# EAGLE design Laser Breakout (EAGLE 6.5.0)
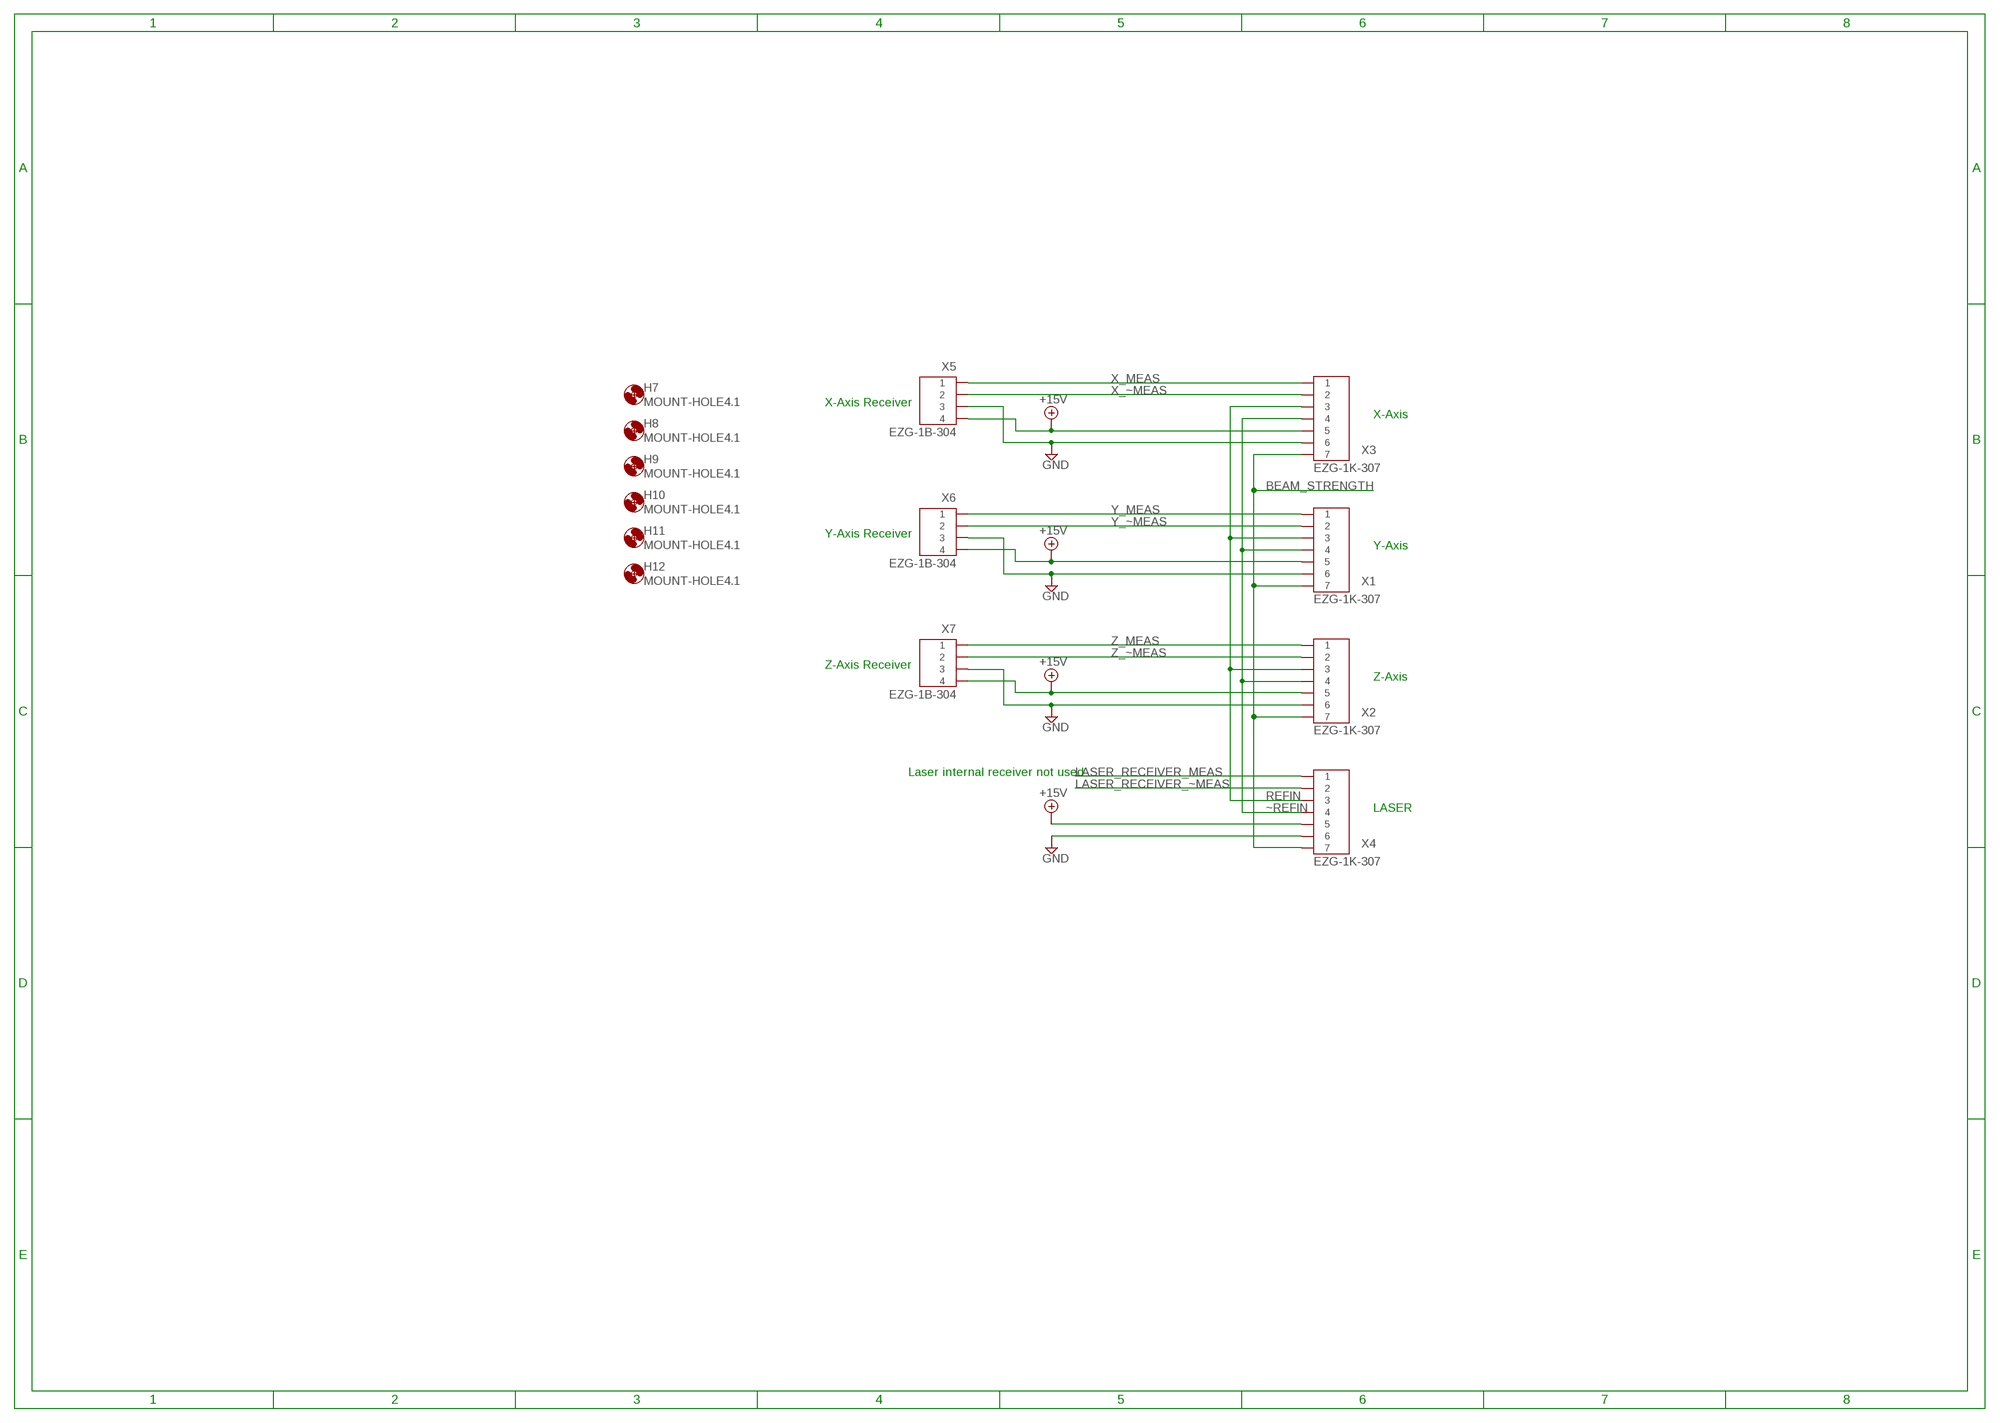
[diagram p0: schematic, sheet 1]

## Parts
H7  MOUNT-HOLE4.1  [4,1]
H8  MOUNT-HOLE4.1  [4,1]
H9  MOUNT-HOLE4.1  [4,1]
H10  MOUNT-HOLE4.1  [4,1]
H11  MOUNT-HOLE4.1  [4,1]
H12  MOUNT-HOLE4.1  [4,1]
X1  EZG-1K-307  [EZG-1B-1K-307]
X2  EZG-1K-307  [EZG-1B-1K-307]
X3  EZG-1K-307  [EZG-1B-1K-307]
X4  EZG-1K-307  [EZG-1B-1K-307]
X5  EZG-1B-304  [EZG-1B-1K-304]
X6  EZG-1B-304  [EZG-1B-1K-304]
X7  EZG-1B-304  [EZG-1B-1K-304]

## Nets
+15V: X1.5 X2.5 X3.5 X4.5 X5.4 X6.4 X7.4
BEAM_STRENGTH: X1.7 X2.7 X3.7 X4.7
GND: X1.6 X2.6 X3.6 X4.6 X5.3 X6.3 X7.3
LASER_RECEIVER_MEAS: X4.1
LASER_RECEIVER_~MEAS: X4.2
REFIN: X1.3 X2.3 X3.3 X4.3
X_MEAS: X3.1 X5.1
X_~MEAS: X3.2 X5.2
Y_MEAS: X1.1 X6.1
Y_~MEAS: X1.2 X6.2
Z_MEAS: X2.1 X7.1
Z_~MEAS: X2.2 X7.2
~REFIN: X1.4 X2.4 X3.4 X4.4

## Notes on the sheet
- X-Axis Receiver
- X-Axis
- Y-Axis Receiver
- Y-Axis
- Z-Axis Receiver
- Z-Axis
- Laser internal receiver not used
- LASER

## Library data of the parts
H7-H12 = holes:MOUNT-HOLE: MOUNTING HOLE with drill center marker
X1-X4 = con-lemo:EZG-?-307: LEMO Connector Source: http://www.lemo.com/pdfs/catalog/ROW/German/unipole_multipole.pdf; OC_FARNELL: unknown; OC_NEWARK: unknown
X5-X7 = con-lemo:EZG-?-304: LEMO Connector Source: http://www.lemo.com/pdfs/catalog/ROW/German/unipole_multipole.pdf; OC_FARNELL: unknown; OC_NEWARK: unknown

## Net classes
0 default: width 0.152 mm, drill 0.152 mm, clearance 0.152 mm

## Board
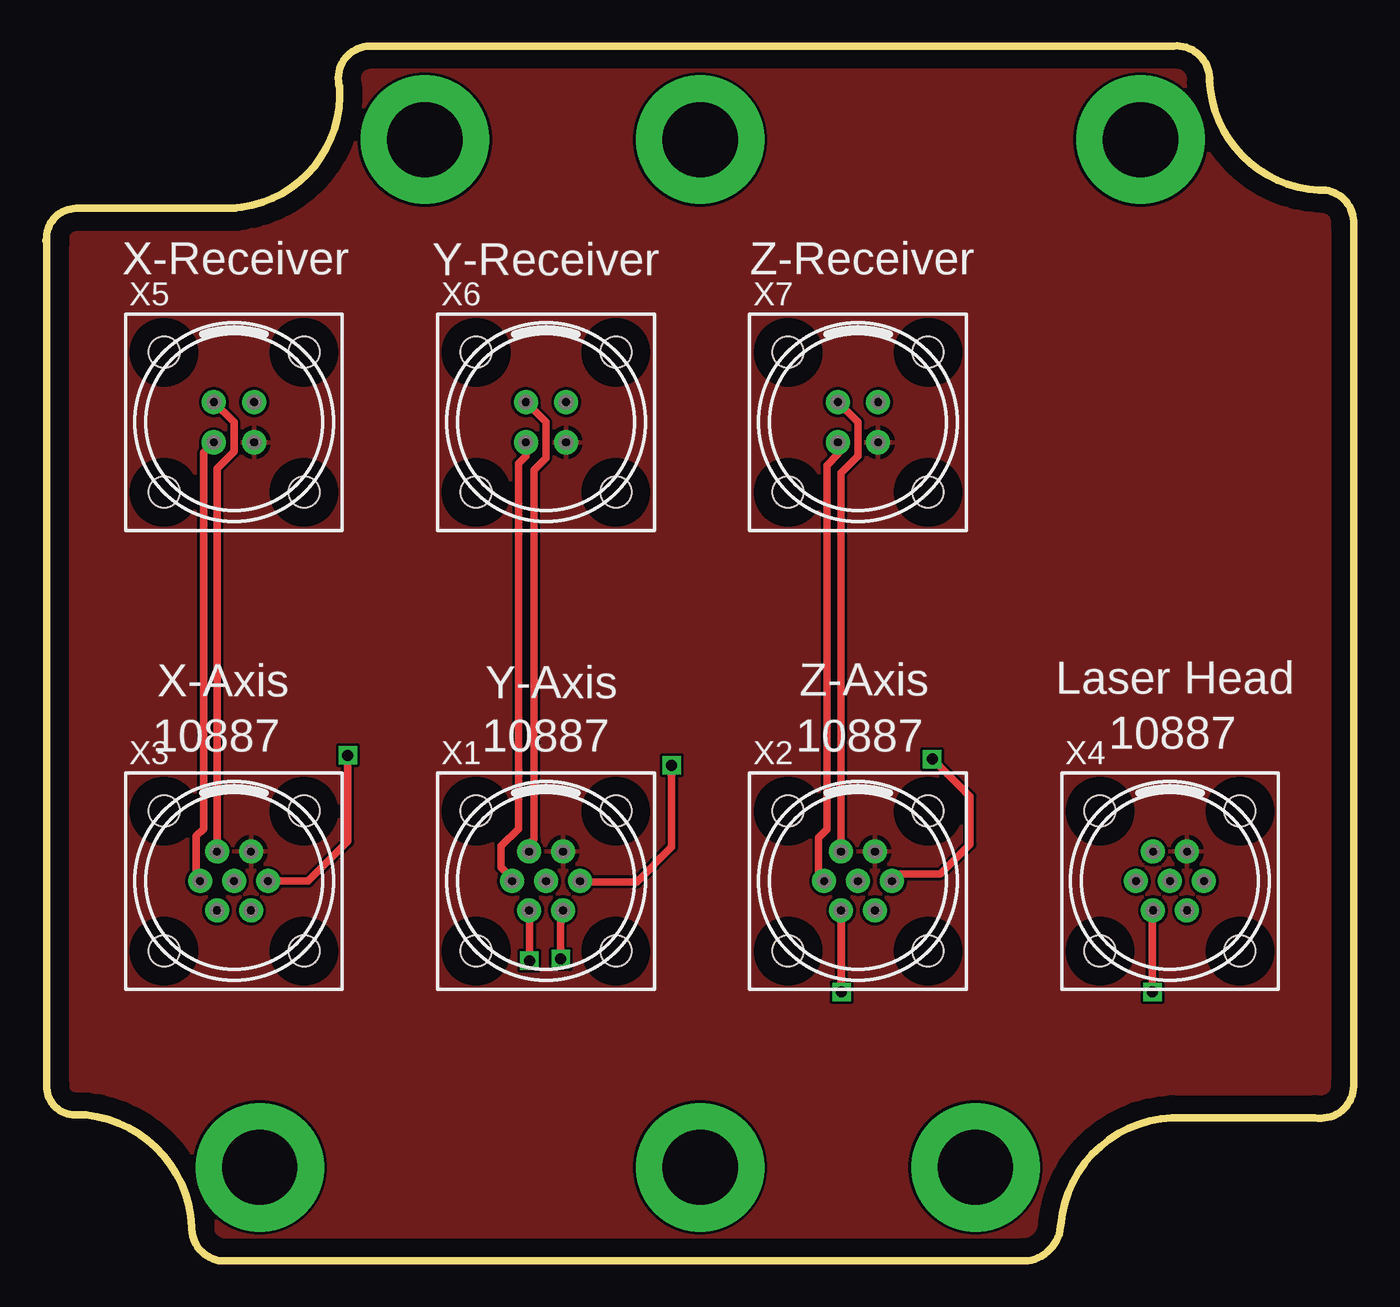
[diagram p1: board, top side]
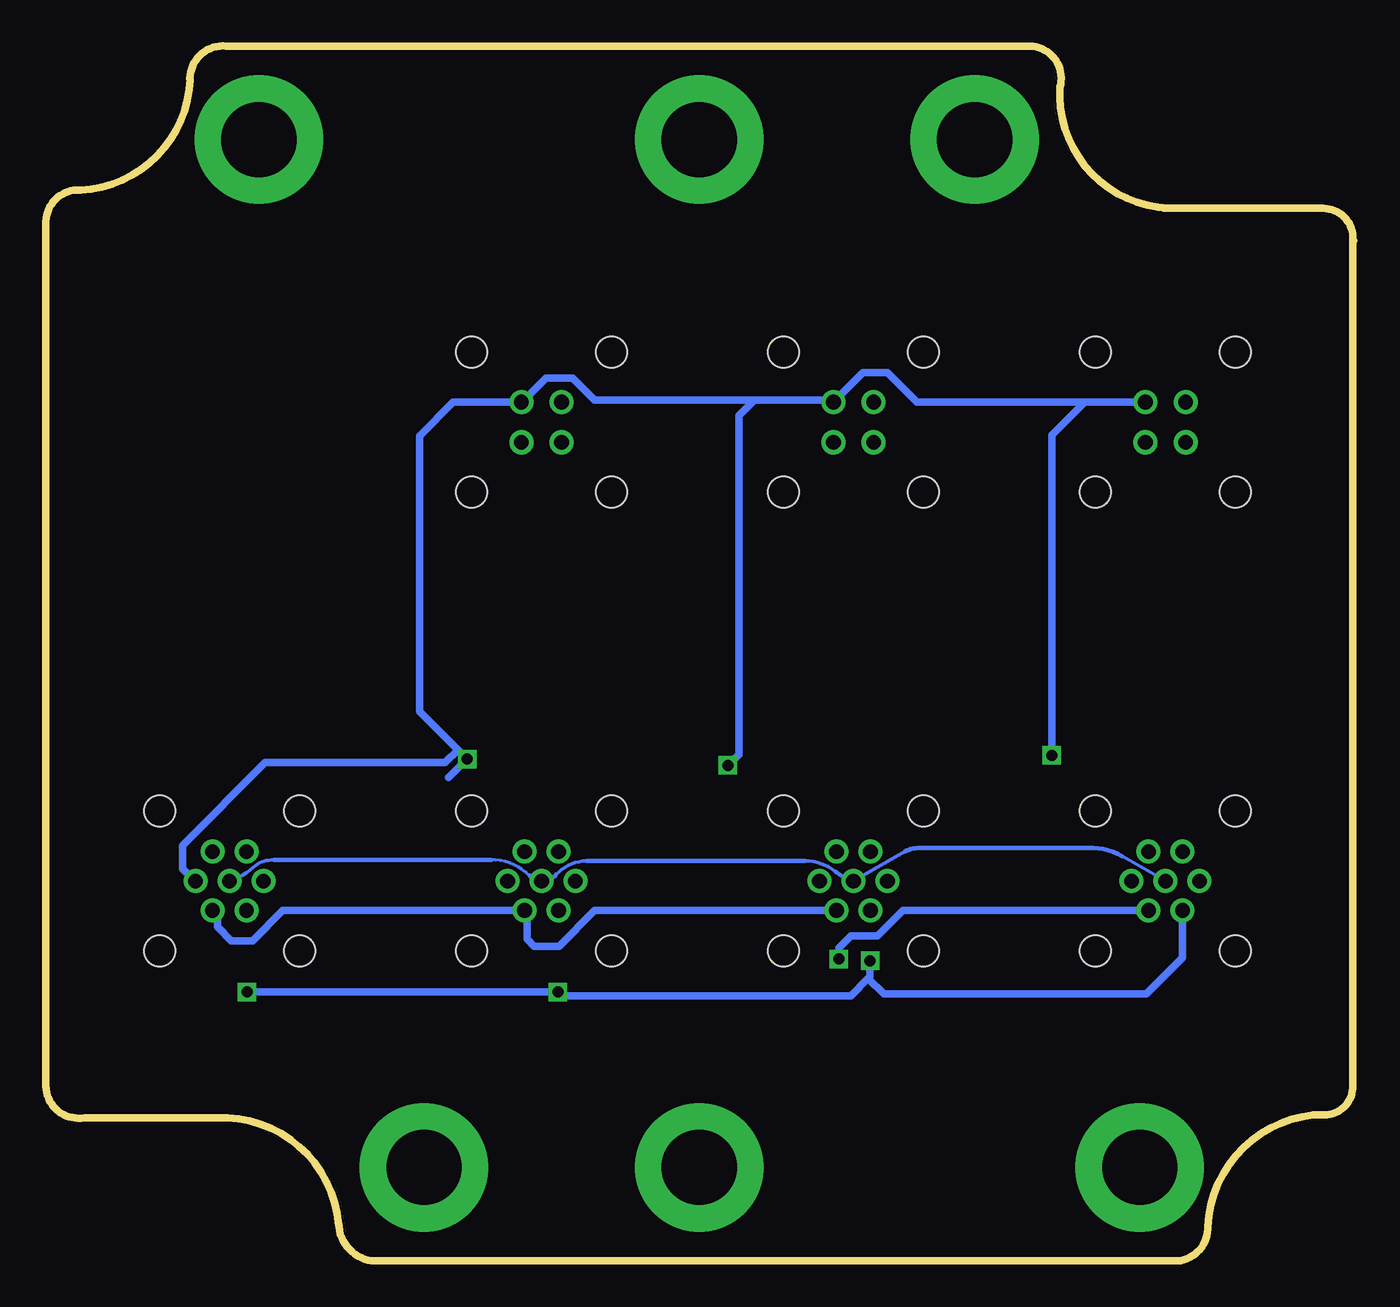
[diagram p2: board, bottom side, seen from below]

Size 71.25 x 66.21 mm. Coordinates in mm from the lower left corner, seen from the top.
Outline: 0.05,55.5 0.05,9.55 arc92 1.6,7.95 2.2,7.95 arc-81 7.95,1.85
Outline: 0.05,55.5 0.05,55.55 0,55.6
Outline: 9.6,0 arc-89 7.95,1.9
Outline: 9.65,0 53.1,0
Outline: 53.1,0 53.2,0
Outline: 55.3,1.95 arc-83 61.35,7.8 69.15,7.8 arc104 71.25,9.7 71.25,56.4
Outline: 55.3,2.05 arc-93 53.1,0
Outline: 17.55,66.2 61.45,66.2 arc-99 63.4,64.25
Outline: 69.35,58.35 arc-85 63.4,64.4
Outline: 69.4,58.35 arc-97 71.25,56.5
Outline: 0.05,55.5 arc-98 1.65,57.35 10.1,57.35
Outline: 10.1,57.35 10.35,57.35
Outline: 16,64 arc-91 10.1,57.35
Outline: 16,63.95 arc-105 17.65,66.2
Copper layers (1*16): Top 0.035mm / dielectric 1.5mm / Bottom 0.035mm
Design rules "default *": minimum track width 6mil, minimum drill 15mil, track to track 6mil, track to pad 6mil, pad to pad 6mil, via to via 6mil, smd to smd 6mil, copper to edge 40mil, drill to drill 8mil, minimum pad ring 10mil, minimum via ring 8mil, stop-mask expansion 4mil, vias tented up to drill 0mil, thermal gap 10mil

### Footprints (pad centres in the part's own frame; a part is rotated, then mirrored left to right if it is on the bottom)
4,1 = drill 4.1 pad 7: P$1 0,0
EZG-1B-1K-307 = drill 0.8 pad 1.3: 1 -0.925,1.602; 2 -1.85,0; 3 -0.925,-1.602; 4 0.925,-1.602; 5 1.85,0; 6 0.925,1.602; 7 0,0 | hole 1.7: -3.81,3.81; 3.81,3.81; 3.81,-3.81; -3.81,-3.81
EZG-1B-1K-304 = drill 0.8 pad 1.1: 1 -1.096,1.096; 2 -1.096,-1.096; 3 1.096,-1.096; 4 1.096,1.096 | hole 1.7: -3.81,3.81; 3.81,3.81; 3.81,-3.81; -3.81,-3.81

### Placement (x,y rotation side)
H7  11.65,5.1 0 top
H8  35.65,5.1 0 top
H9  50.65,5.1 0 top
H10  20.65,61.1 0 top
H11  35.65,61.1 0 top
H12  59.65,61.1 0 top
X1  27.25,20.7 0 top
X2  44.25,20.7 0 top
X3  10.25,20.7 0 top
X4  61.25,20.7 0 top
X5  10.25,45.7 0 top
X6  27.25,45.7 0 top
X7  44.25,45.7 0 top

### Tracks (layer width: path | path; a pad name or v marks a point on that pad's centre or on a via)
+15V  (via drill 0.6)
  Top 0.406: X2.5 46.15,20.7 46.55,21.1 48.75,21.1 50.35,22.7 50.35,25.3 v48.3,27.35 | X5.4 11.5,46.8 | v34.1,27 34.1,22.55 32.2,20.65 29.15,20.65 X1.5 | X3.5 14.3,20.7 16.45,22.85 v16.45,27.55
  Bottom 0.254: X6.4 | X7.4
  Bottom 0.406: X5.4 14.65,46.8 | 14.65,46.8 23.8,46.8 25.4,48.4 26.74,48.4 X6.4 28.45,46.9 32.65,46.9 | X4.5 63.15,20.7 63.8,21.35 63.8,22.65 59.3,27.15 49.5,27.15 48.8,27.85 | 49.3,26.35 v48.3,27.35 48.8,27.85 | 32.65,46.9 41.35,46.9 42.55,48.1 44,48.1 45.3,46.8 X7.4 49.05,46.8 50.9,44.95 50.9,29.95 48.8,27.85 | 32.65,46.9 33.5,46.05 33.5,27.6 v34.1,27 | v16.45,27.55 16.45,45 14.65,46.8
BEAM_STRENGTH
  Bottom 0.152: 44.9,21 arc-46 47,21.85 | X3.7 12.6,22.05
  Bottom 0.178: 60.8,20.9 arc-18 59.95,21.45 arc44 58.85,21.85 | 43.45,21.05 arc46 41.8,21.8 | 29.9,21.8 arc39 28.2,21.2 | X1.7 24.45,22.3
  Bottom 0.254: X4.7 60.8,20.9 | 58.85,21.85 47,21.85 | 44.9,21 44.6,20.7 X2.7 arc-47 43.45,21.05 | 41.8,21.8 29.9,21.8 | 12.6,22.05 arc-32 14.45,22.5 23.65,22.5 arc-31 24.45,22.3 | 28.2,21.2 arc-22 X1.7
GND
  Top 0.406: 45.17,44.44 X7.3
  pour Top: 2,7.95 1.1,7.95 0.1,8.95 0.1,56.25 1.2,57.35 10.25,57.35 arc104 15.95,64.6 arc-90 17.6,66.25 18.75,66.25 61.95,66.25 62,66.25 62.15,66.1 62.35,66.1 63.4,65.05 63.4,65 arc85 69.5,58.35 arc-77 71.3,56.65 71.25,56.6 71.25,9.4 71.25,9.2 71.25,9 70.05,7.8 69.35,7.8 61.25,7.8 arc90 55.3,1.9 arc-104 52.9,0.05 9.5,0.05 arc-98 7.9,1.9 arc51 6.9,5.1 arc15 4,7.5 arc39
REFIN  (via drill 0.6)
  Top 0.406: X1.3 26.35,19.08 v26.35,16.35 | v60.3,14.65 60.3,19.08 X4.3 | v43.35,14.65 43.35,19.08 X2.3 43.33,14.68 v43.35,14.65
  Bottom 0.406: v26.35,16.35 26.35,15.5 26.45,15.4 | 26.45,15.4 27.4,14.45 43.15,14.45 v43.35,14.65 v60.3,14.65 | X3.3 9.32,16.53 11.3,14.55 25.6,14.55 26.45,15.4
X_MEAS
  Top 0.406: X3.1 9.32,43.18 10.25,44.1 10.25,45.7 X5.1
X_~MEAS
  Top 0.406: 8.9,44.61 X5.2 8.6,44.05 8.6,23.55 8.2,23.15 8.2,20.9 X3.2
Y_MEAS
  Top 0.406: X1.1 26.32,22.73 26.6,23 26.6,43.1 27.25,43.75 27.25,45.7 X6.1
Y_~MEAS
  Top 0.406: X1.2 25.4,20.85 24.8,21.45 24.8,22.6 25.75,23.55 25.75,43.45 26.15,43.86 X6.2
Z_MEAS
  Top 0.406: X2.1 43.33,42.93 44.25,43.85 44.25,45.7 X7.1
Z_~MEAS
  Top 0.406: 42.4,21.05 X2.2 42.1,21 42.1,23.05 42.55,23.5 42.55,43.35 43.15,43.96 X7.2
~REFIN  (via drill 0.6)
  Top 0.406: v28.05,16.45 28.05,18.98 X1.4
  Bottom 0.406: v28.05,16.45 28.05,17.05 27.4,17.7 25.95,17.7 24.55,19.1 23.65,19.1 X3.4 | X1.4 41.35,19.1 43.3,17.15 44.65,17.15 45.05,17.55 45.05,18.98 X2.4 58.35,19.1 60,17.45 61.15,17.45 61.9,18.2 61.9,18.83 X4.4

### Text on the board
tPlace: X-Receiver | Y-Receiver | Z-Receiver | X-Axis | Y-Axis | Z-Axis | Laser Head | 10887 | 10887 | 10887 | 10887